# Altium schematic sheet TK520_GDT-Trafo.SchDoc: TK520 GDT-Trafo
size A3; Author: Øystein Smith; Organization: Omega Verksted; DocumentNumber: 13; Revision: 1; SheetNumber: 13; SheetTotal: 20
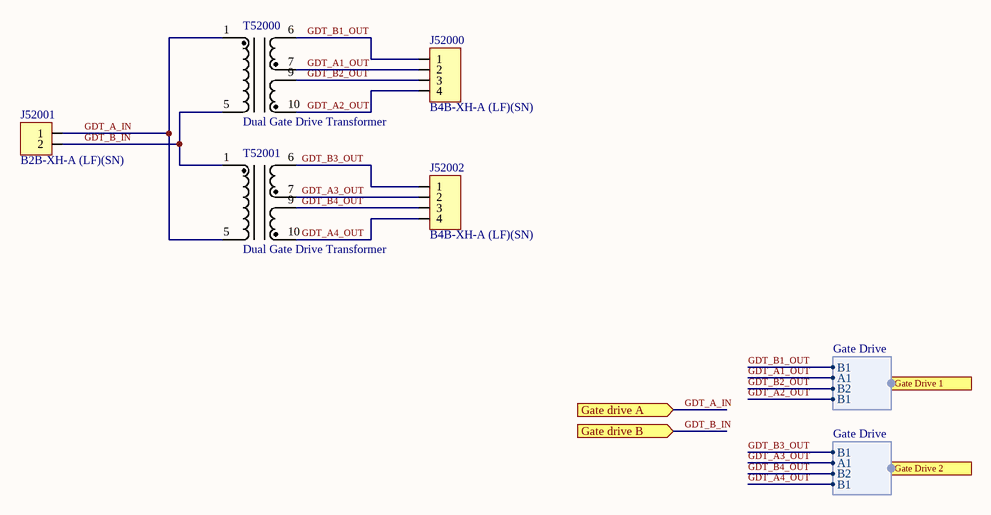
[diagram p0: TK520_GDT-Trafo.SchDoc]

## Parts
J52000  B4B-XH-A (LF)(SN)  [JST_4P]
J52001  B2B-XH-A (LF)(SN)  [JST_2P]
J52002  B4B-XH-A (LF)(SN)  [JST_4P]
T52000  Dual Gate Drive Transformer  [SD250-3]
T52001  Dual Gate Drive Transformer  [SD250-3]

## Ports
Gate Drive 1 (harness Gate Drive), Gate Drive 2 (harness Gate Drive), Gate drive A (in), Gate drive B (in)

## Harnesses
Gate Drive: B1, A1, B2, B1

## Nets
GDT_A1_OUT: J52000.2 T52000.7 ; port Gate Drive 1.A1
GDT_A2_OUT: J52000.1 J52000.4 T52000.6 T52000.10 ; port Gate Drive 1.B1  [also labelled GDT_B1_OUT]
GDT_A3_OUT: J52002.2 T52001.7 ; port Gate Drive 2.A1
GDT_A4_OUT: J52002.1 J52002.4 T52001.6 T52001.10 ; port Gate Drive 2.B1  [also labelled GDT_B3_OUT]
GDT_A_IN: J52001.1 T52000.1 T52001.5 ; port Gate drive A
GDT_B2_OUT: J52000.3 T52000.9 ; port Gate Drive 1.B2
GDT_B4_OUT: J52002.3 T52001.9 ; port Gate Drive 2.B2
GDT_B_IN: J52001.2 T52000.5 T52001.1 ; port Gate drive B

## Notes on the sheet
- Size:
- Date:
- Title:
- A3
- Revision:
- Sheet
- of
- Author:
- File:

## Library data of the parts
J52000 J52002 = 3046: JST 4pin (pris pr. stk.); id: 3046; rad: 3; rom: OV; lager_type: Fremlager; dybde: 0; hylle: 6; antall: 94; pakke_opprettet_av: 815; pris: 2; nokkelord: Connector, Kontakt; pakketype: TH; leverandor_varenr: 1516278; leverandor: Farnell; komponenttype: 11; pakke_opprettet: 28/06/2014 18:25:23; symbol_opprettet_av: 815; symbol_opprettet: 28/06/2014 15:33:28; navn: B4B-XH-A (LF)(SN); produsent: JST
J52001 = 4043: JST 2pin (pris pr. stk.); id: 4043; rad: 3; rom: OV; lager_type: Fremlager; dybde: 0; hylle: 6; antall: 120; pakke_opprettet_av: 815; pris: 2; nokkelord: Connector, Kontakt; pakketype: TH; leverandor_varenr: 1516276; leverandor: Farnell; komponenttype: 11; pakke_opprettet: 28/06/2014 18:25:03; symbol_opprettet_av: 815; symbol_opprettet: 28/06/2014 15:33:17; navn: B2B-XH-A (LF)(SN); produsent: JST
T52000 T52001 = 3215: pakke_opprettet_av: 815; pris: 100; nokkelord: GDT, Tesla; pakketype: TH; produsent: Coilcraft; id: 3215; komponenttype: 3; navn: SD250-3; pakke_opprettet: 28/06/2014 18:37:26; symbol_opprettet_av: 815; symbol_opprettet: 28/06/2014 15:27:34